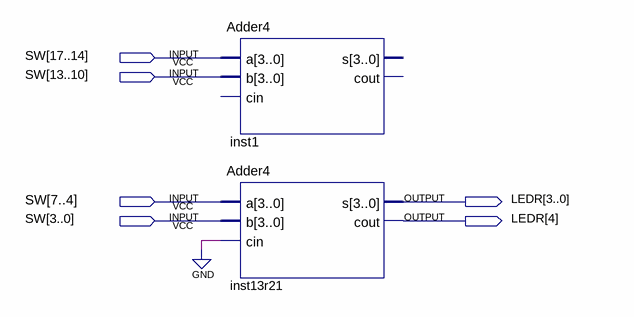
[diagram p0: schematic sheet]
// Quartus schematic AdderDemo.bdf as structural Verilog: 2 symbols, 6 pins
module AdderDemo (
  input  [17:0] SW,
  output [4:0] LEDR
);

  Adder4 inst1 (.a(SW[17:14]), .b(SW[13:10]));  // open: cin, s, cout
  Adder4 inst13r21 (.a(SW[7:4]), .b(SW[3:0]), .cin(1'b0), .s(LEDR[3:0]), .cout(LEDR[4]));
endmodule
